# EAGLE design PCB v1.0 (EAGLE 9.6.2)
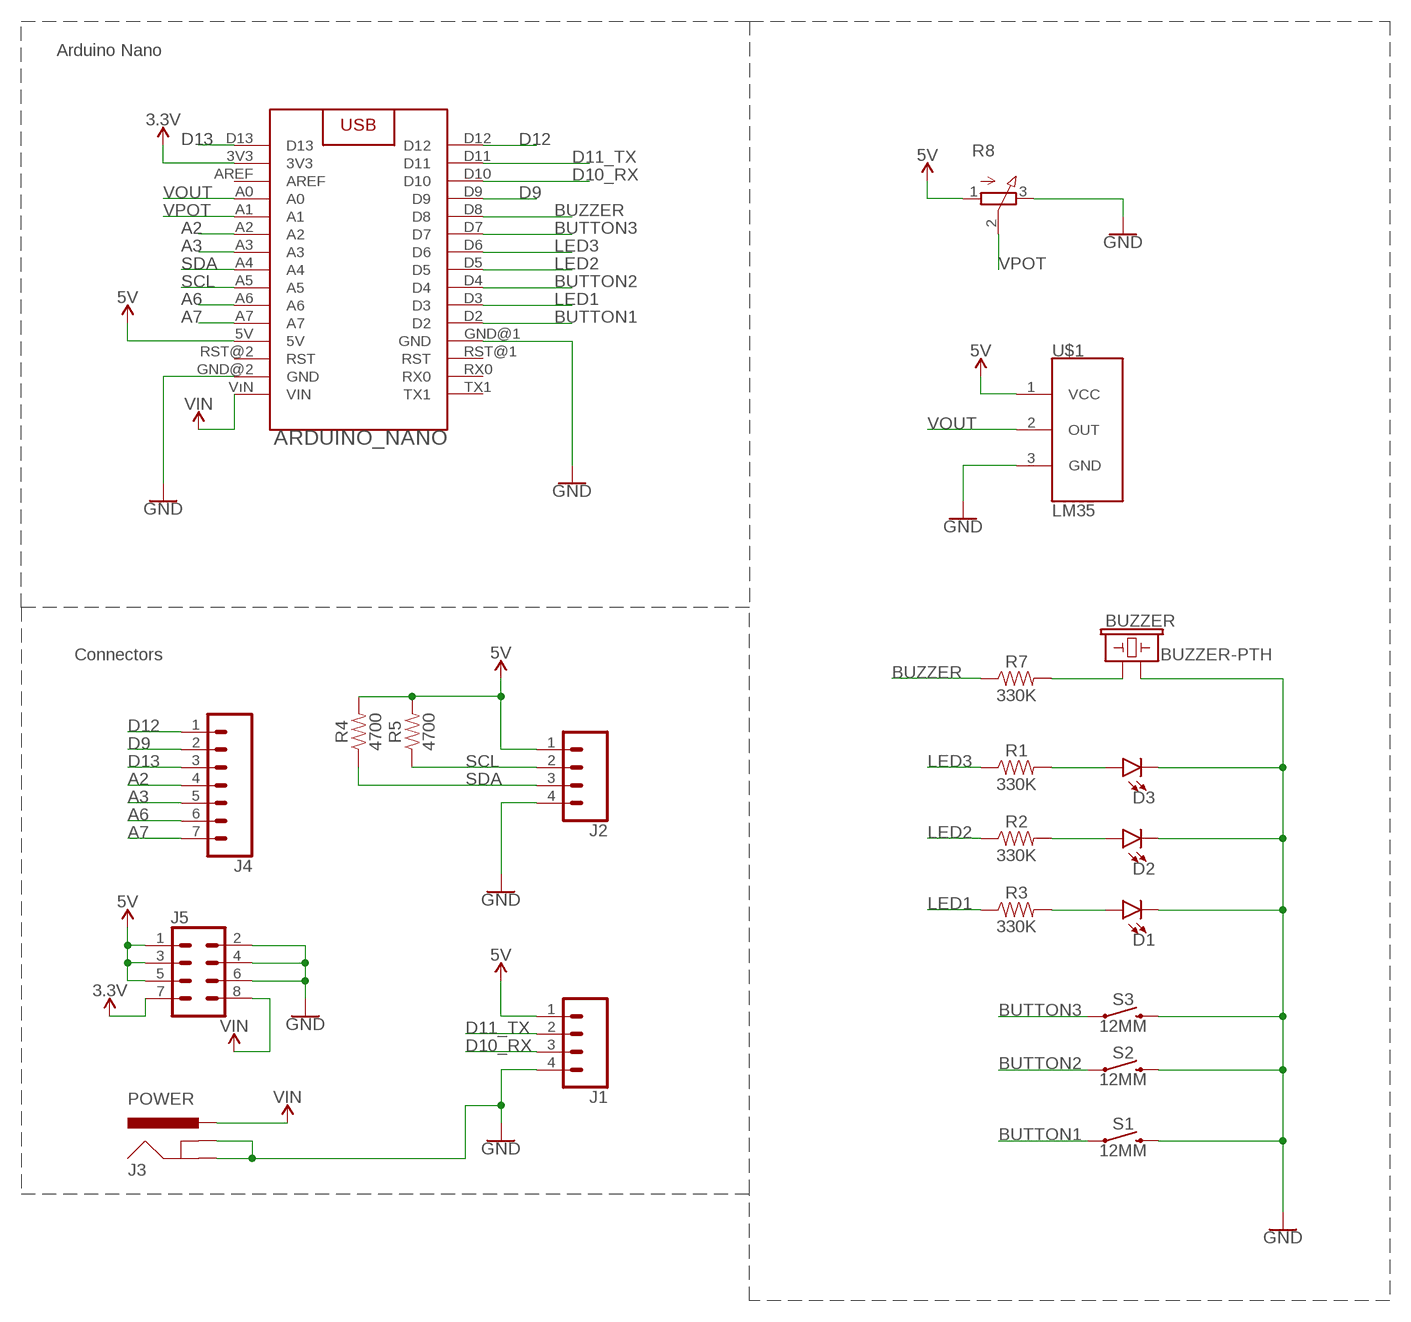
[diagram p0: schematic, sheet 1]

## Parts
ARDUINO_NANO  ARDUINO_NANO  [ARDUINO_NANO]
BUZZER  BUZZER-PTH  [BUZZER-12MM]
D1  LED-3MM-NO_SILK  [LED_3MM-NS]
D2  LED-3MM-NO_SILK  [LED_3MM-NS]
D3  LED-3MM-NO_SILK  [LED_3MM-NS]
J1  CONN_04PTH  [1X04]
J2  CONN_04PTH  [1X04]
J3  POWER  POWER_JACK  [POWER_JACK_PTH]
J4  CONN_07  [1X07]
J5  CONN_04X2  [2X4]
R1  330K  1KOHM-HORIZ-1/4W-5%  [AXIAL-0.3]
R2  330K  1KOHM-HORIZ-1/4W-5%  [AXIAL-0.3]
R3  330K  1KOHM-HORIZ-1/4W-5%  [AXIAL-0.3]
R4  4700  1KOHM-HORIZ-1/4W-5%  [AXIAL-0.3]
R5  4700  1KOHM-HORIZ-1/4W-5%  [AXIAL-0.3]
R7  330K  1KOHM-HORIZ-1/4W-5%  [AXIAL-0.3]
R8  3RP/1610N  [3RP/1610N]
S1  12MM  MOMENTARY-SWITCH-SPST-PTH-12MM  [TACTILE_SWITCH_PTH_12MM]
S2  12MM  MOMENTARY-SWITCH-SPST-PTH-12MM  [TACTILE_SWITCH_PTH_12MM]
S3  12MM  MOMENTARY-SWITCH-SPST-PTH-12MM  [TACTILE_SWITCH_PTH_12MM]
U$1  LM35  [TO-92]

## Nets
3.3V: ARDUINO_NANO.3V3 J5.7
5V: ARDUINO_NANO.5V J1.1 J2.1 J5.1 J5.3 J5.5 R4.P$2 R5.P$2 R8.1(A) U$1.1(VCC)
A2: ARDUINO_NANO.A2 J4.4
A3: ARDUINO_NANO.A3 J4.5
A6: ARDUINO_NANO.A6 J4.6
A7: ARDUINO_NANO.A7 J4.7
BUTTON1: ARDUINO_NANO.D2 S1.1
BUTTON2: ARDUINO_NANO.D4 S2.1
BUTTON3: ARDUINO_NANO.D7 S3.1
BUZZER: ARDUINO_NANO.D8 R7.P$1
D9: ARDUINO_NANO.D9 J4.2
D10_RX: ARDUINO_NANO.D10 J1.3
D11_TX: ARDUINO_NANO.D11 J1.2
D12: ARDUINO_NANO.D12 J4.1
D13: ARDUINO_NANO.D13 J4.3
GND: ARDUINO_NANO.GND@1(GND) ARDUINO_NANO.GND@2(GND) BUZZER.- D1.K(C) D2.K(C) D3.K(C) J1.4 J2.4 J3.GND J3.GNDBREAK J5.2 J5.4 J5.6 R8.3(E) S1.3 S2.3 S3.3 U$1.3(GND)
LED1: ARDUINO_NANO.D3 R3.P$1
LED2: ARDUINO_NANO.D5 R2.P$1
LED3: ARDUINO_NANO.D6 R1.P$1
N$1: BUZZER.+ R7.P$2
N$2: D3.A R1.P$2
N$3: D2.A R2.P$2
N$4: D1.A R3.P$2
SCL: ARDUINO_NANO.A5 J2.2 R5.P$1
SDA: ARDUINO_NANO.A4 J2.3 R4.P$1
VIN: ARDUINO_NANO.VıN(VIN) J3.PWR J5.8
VOUT: ARDUINO_NANO.A0 U$1.2(OUT)
VPOT: ARDUINO_NANO.A1 R8.2(S)
Unconnected: ARDUINO_NANO.AREF ARDUINO_NANO.RST@1(RST) ARDUINO_NANO.RST@2(RST) ARDUINO_NANO.RX0 ARDUINO_NANO.TX1

## Notes on the sheet
- Arduino Nano
- Connectors

## Library data of the parts
ARDUINO_NANO = library_custom:ARDUINO_NANO: Arduino Nano Device
BUZZER = SparkFun-Electromechanical:BUZZER: Buzzer Small round buzzers that operate around the audible 2kHz range. You can use these as speakers to create simple music or user interfaces. Variant Overview: PTH - Mini Speaker - PC Mount 12mm 2.048kHz <https://www.sparkfun.com/products/7950> PTH_KIT - Mini Speaker - PC Mount 12mm 2.048kHz <https://www.sparkfun.com/products/7950> KIT simplifies soldering by adding stop mask to one side of the pads. PTH_NO_SILK - Mini Speaker - PC Mount 12mm 2.048kHz <https://www.sparkfun.com/products/7950> No silkscreen indicator of buzzer outline. PTH_KIT_NO_SILK - Mini Speaker - PC Mount 12mm 2.048kHz <https://www.sparkfun.com/products/7950> KIT package w/o silkscreen SMD - Buzzer Audio Magnetic (CCV-084B16) SMD buzzer used on, e.g. the LilyPad Buzzer <https://www.sparkfun.com/products/8463> and RFID USB Reader <https://www.sparkfun.com/products/9963>. SMD_KIT - Buzzer Audio Magnetic (CCV-084B16) SMD Buzzer with elongated pins to make soldering easier. Used on the SparkFun Simon Says - Surface Mount Soldering Kit <https://www.sparkfun.com/products/10935>. SMD-SQUARE - Buzzer Audio Magnetic (COMP-15701) SMT square buzzer with one chamfered corner.; PROD_ID: COMP-08253; SF_SKU: COM-07950
D1-D3 = SparkFun-LED:LED: LED (Generic) Standard schematic elements and footprints for 5mm, 3mm, 1206, and 0603 sized LEDs. Generic LEDs with no color specified.
J1 J2 = SparkFun-Connectors:CONN_04: Multi connection point. Often used as Generic Header-pin footprint for 0.1 inch spaced/style header connections On any of the 0.1 inch spaced packages, you can populate with these: Break Away Headers - Straight <https://www.sparkfun.com/products/116> (PRT-00116) Break Away Male Headers - Right Angle <https://www.sparkfun.com/products/553> (PRT-00553) Female Headers <https://www.sparkfun.com/products/115> (PRT-00115) Break Away Headers - Machine Pin <https://www.sparkfun.com/products/117> (PRT-00117) Break Away Female Headers - Swiss Machine Pin <https://www.sparkfun.com/products/743> (PRT-00743) For SCREWTERMINALS and SPRING TERMINALS visit here: Screw Terimnals on SparkFun.com <https://www.sparkfun.com/search/results?term=Screw+Terminals> (5mm/3.5mm/2.54mm spacing) This device is also useful as a general connection point to wire up your design to another part of your project. Our various solder wires solder well into these plated through hole pads. Hook-Up Wire - Assortment (Stranded, 22 AWG) <https://www.sparkfun.com/products/11375> (PRT-11375) Hook-Up Wire - Assortment (Solid Core, 22 AWG) <https://www.sparkfun.com/products/11367> (PRT-11367) View the entire wire category on our website here <https://www.sparkfun.com/categories/141> Special notes: Molex polarized connector foot print use with SKU : PRT-08231 with associated crimp pins and housings. 1MM SMD Version SKU: PRT-10208; PROD_ID: CONN-09696
J3 = SparkFun-Connectors:POWER_JACK: Power Jack Connector This is the standard 5.5mm barrel jack for power. The PTH is the most common, proven, reliable, footprint. The Slot footprint only works if the mill layer is transmitted to the PCB fab house so be warned. Here are the connectors we sell at SparkFun: DC Barrel Power Jack/Connector <https://www.sparkfun.com/products/119> (PRT-00119) DC Barrel Power Jack/Connector (SMD) <https://www.sparkfun.com/products/12748> (PRT-12748) DC Barrel Jack Adapter - Breadboard Compatible <https://www.sparkfun.com/products/10811> (PRT-10811) It is used on this SparkFun product (and many, many others): SparkFun RedBoard - Programmed with Arduino <https://www.sparkfun.com/products/12757> (DEV-12757) Also, if you need a mating power supply or connector, please check these out: Wall Adapter Power Supply - 9VDC 650mA <https://www.sparkfun.com/products/298> (TOL-00298) DC Barrel Jack Adapter - Male <https://www.sparkfun.com/products/10287> (PRT-10287); PROD_ID: CONN-08197
J4 = SparkFun-Connectors:CONN_07: Multi connection point. Often used as Generic Header-pin footprint for 0.1 inch spaced/style header connections On any of the 0.1 inch spaced packages, you can populate with these: Break Away Headers - Straight <https://www.sparkfun.com/products/116> (PRT-00116) Break Away Male Headers - Right Angle <https://www.sparkfun.com/products/553> (PRT-00553) Female Headers <https://www.sparkfun.com/products/115> (PRT-00115) Break Away Headers - Machine Pin <https://www.sparkfun.com/products/117> (PRT-00117) Break Away Female Headers - Swiss Machine Pin <https://www.sparkfun.com/products/743> (PRT-00743) For SCREWTERMINALS and SPRING TERMINALS visit here: Screw Terimnals on SparkFun.com <https://www.sparkfun.com/search/results?term=Screw+Terminals> (5mm/3.5mm/2.54mm spacing) This device is also useful as a general connection point to wire up your design to another part of your project. Our various solder wires solder well into these plated through hole pads. Hook-Up Wire - Assortment (Stranded, 22 AWG) <https://www.sparkfun.com/products/11375> (PRT-11375) Hook-Up Wire - Assortment (Solid Core, 22 AWG) <https://www.sparkfun.com/products/11367> (PRT-11367) View the entire wire category on our website here <https://www.sparkfun.com/categories/141> Special notes: Molex polarized connector foot print use with SKU : PRT-08231 with associated crimp pins and housings. 1MM SMD Version SKU: PRT-10208 NOTES ON THE VARIANTS LOCK and LOCK_LONGPADS... This footprint was designed to help hold the alignment of a through-hole component (i.e. 6-pin header) while soldering it into place. You may notice that each hole has been shifted either up or down by 0.005 of an inch from it's more standard position (which is a perfectly straight line). This slight alteration caused the pins (the squares in the middle) to touch the edges of the holes. Because they are alternating, it causes a "brace" to hold the component in place. 0.005 has proven to be the perfect amount of "off-center" position when using our standard breakaway headers. Although looks a little odd when you look at the bare footprint, once you have a header in there, the alteration is very hard to notice. Also,if you push a header all the way into place, it is covered up entirely on the bottom side.
J5 = SparkFun-Connectors:CONN_04X2: Multi connection point. Often used as Generic Header-pin footprint for 0.1 inch spaced/style header connections On any of the 0.1 inch spaced packages, you can populate with these: Break Away Headers - Straight <https://www.sparkfun.com/products/116> (PRT-00116) Break Away Male Headers - Right Angle <https://www.sparkfun.com/products/553> (PRT-00553) Female Headers <https://www.sparkfun.com/products/115> (PRT-00115) Break Away Headers - Machine Pin <https://www.sparkfun.com/products/117> (PRT-00117) Break Away Female Headers - Swiss Machine Pin <https://www.sparkfun.com/products/743> (PRT-00743)
R1-R5 R7 = SparkFun-Resistors:1KOHM: 1kΩ resistor A resistor is a passive two-terminal electrical component that implements electrical resistance as a circuit element. Resistors act to reduce current flow, and, at the same time, act to lower voltage levels within circuits. - Wikipedia; PROD_ID: RES-08380; VALUE: 1k
R8 = pot:3RP/1610N: 16mm Potentiometer one level Source: http://www.alphapotentiometers.net/html/16mm_pot_2.html
S1-S3 = SparkFun-Switches:MOMENTARY-SWITCH-SPST: Momentary Switch (Pushbutton) - SPST Normally-open (NO) SPST momentary switches (buttons, pushbuttons). Variants PTH-12MM - 12mm square, through-hole Momentary Pushbutton Switch - 12mm Square <https://www.sparkfun.com/products/9190> (COM-09190) PTH-6.0MM, PTH-6.0MM-KIT - 6.0mm square, through-hole Mini Pushbutton Switch <https://www.sparkfun.com/products/97> (COM-00097) KIT package intended for soldering kit's - only one side of pads' copper is exposed. PTH-RIGHT-ANGLE-KIT - Right-angle, through-hole Right Angle Tactile Button <https://www.sparkfun.com/products/10791> - Used on SparkFun BigTime Watch Kit <https://www.sparkfun.com/products/11734> SMD-12MM - 12mm square, surface-mount Tactile Button - SMD (12mm) <https://www.sparkfun.com/products/12993> (COM-12993) Used on SparkFun PicoBoard <https://www.sparkfun.com/products/11888> SMD-4.5MM - 4.5mm Square Trackball Switch Used on SparkFun Blackberry Trackballer Breakout <https://www.sparkfun.com/products/13169> SMD-4.6MMX2.8MM - 4.60mm x 2.80mm, surface mount Used on SparkFun Pro Micro - RP2040 <https://www.sparkfun.com/products/17717> SMD-5.2MM, SMD-5.2-REDUNDANT - 5.2mm square, surface-mount Mini Pushbutton Switch - SMD <https://www.sparkfun.com/products/8720> (COM-08720) Used on Arduino Pro Mini <https://www.sparkfun.com/products/11114> REDUNDANT package connects both switch circuits together SMD-6.0X3.5MM - 6.0 x 3.5mm, surface mount Momentary Reset Switch SMD <https://www.sparkfun.com/products/8229> (COM-08229) SMD-6.2MM-TALL - 6.2mm square, surface mount Tactile Button - SMD (6mm) <https://www.sparkfun.com/products/12992> Used on SparkFun Digital Sandbox <https://www.sparkfun.com/products/12651> SMD-RIGHT-ANGLE - Right-angle, surface mount Used on SparkFun Block for Intel® Edison - Arduino <https://www.sparkfun.com/products/13036>; PROD_ID: SWCH-09185; SF_SKU: COM-09190
U$1 = library_custom:LM35

## Board
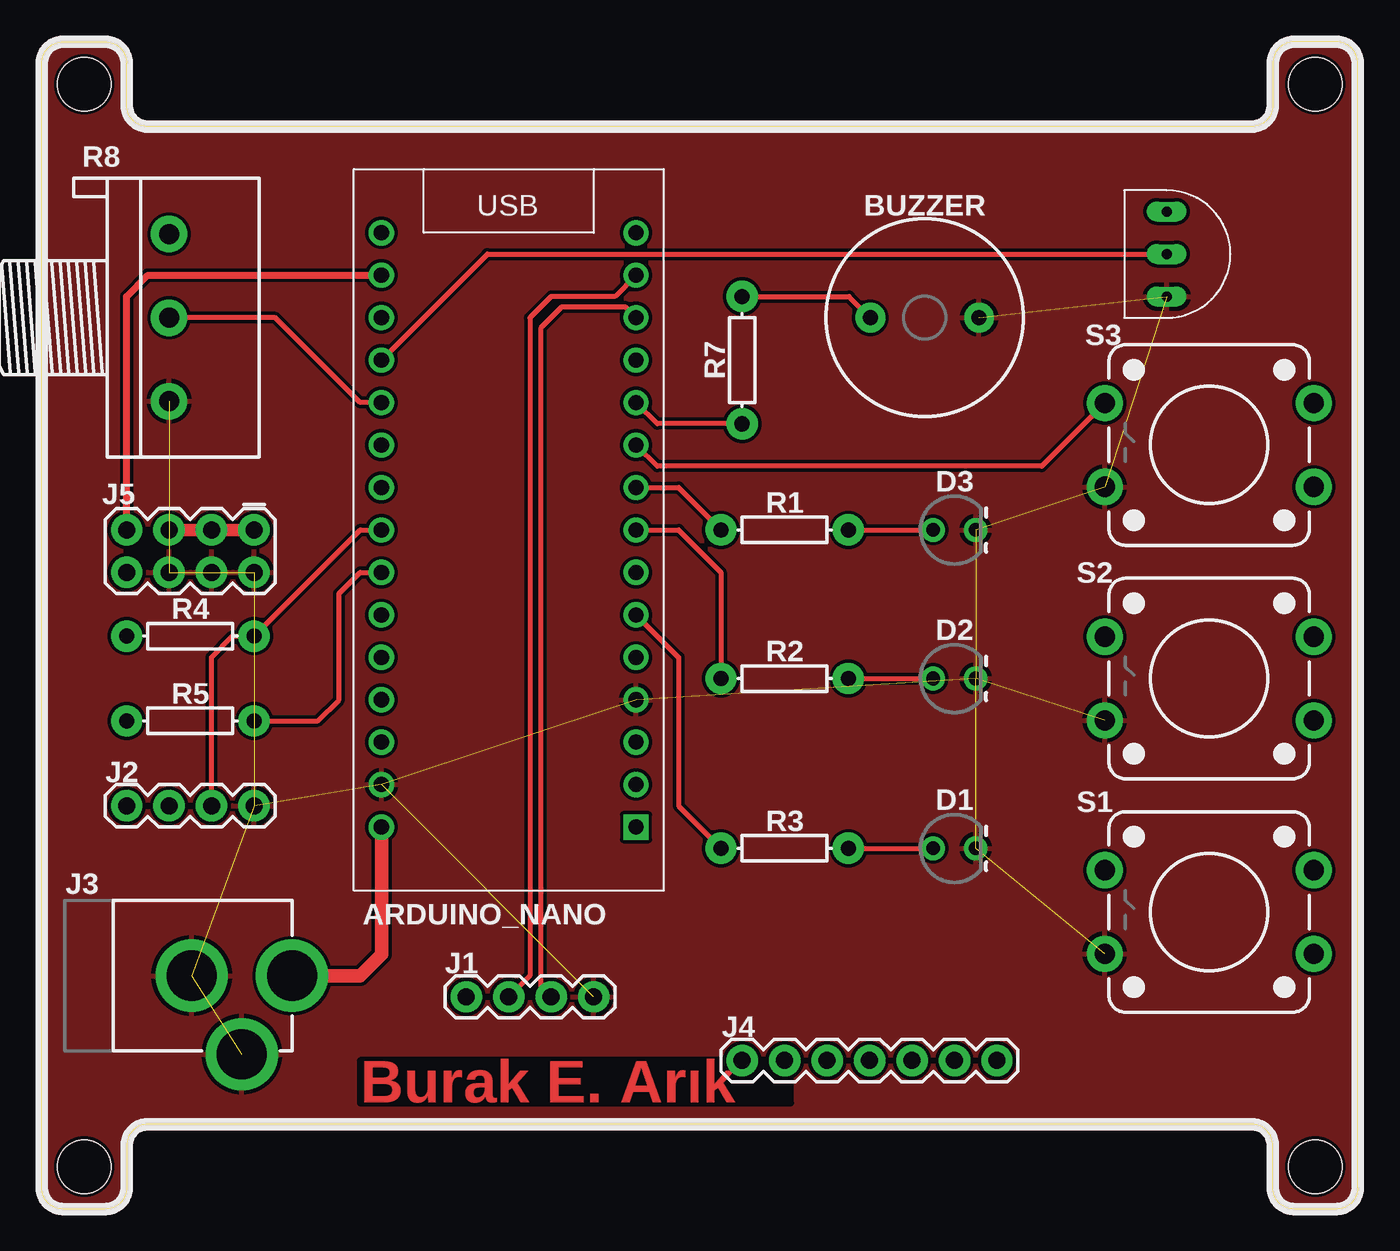
[diagram p1: board, top side]
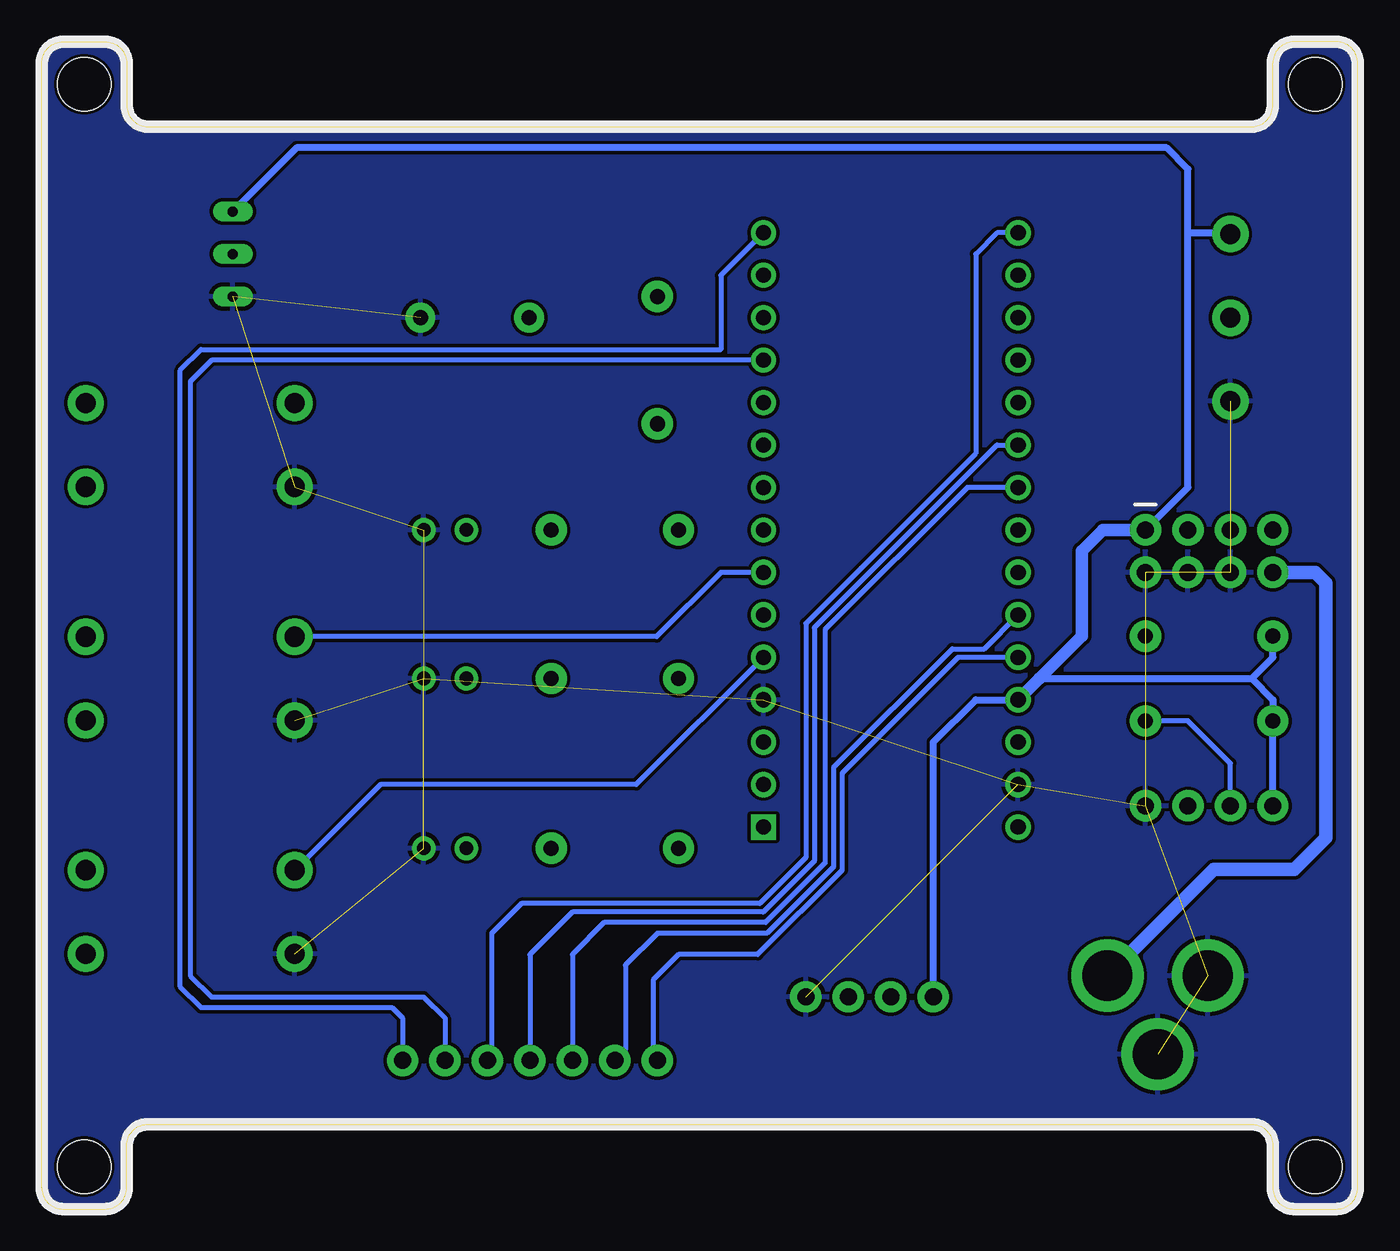
[diagram p2: board, bottom side, seen from below]

Size 78.74 x 69.85 mm. Coordinates in mm from the lower left corner, seen from the top.
Outline: 77.47,0 74.93,0 arc-90 73.66,1.27 73.66,3.81 arc90 72.39,5.08 6.35,5.08 arc90 5.08,3.81 5.08,1.27 arc-90 3.81,0 1.27,0 arc-90 0,1.27 0,68.58 arc-90 1.27,69.85 3.81,69.85 arc-90 5.08,68.58 5.08,66.04 arc90 6.35,64.77 72.39,64.77 arc90 73.66,66.04 73.66,68.58 arc-90 74.93,69.85 77.47,69.85 arc-90 78.74,68.58 78.74,1.27 arc-90 77.47,0
Copper layers (1*16): Top 0.035mm / dielectric 1.5mm / Bottom 0.035mm
Design rules "SparkFun": minimum track width 8mil, minimum drill 20mil, track to track 8mil, track to pad 8mil, pad to pad 8mil, via to via 8mil, smd to smd 8mil, copper to edge 8mil, drill to drill 8mil, minimum pad ring 12mil, minimum via ring 10mil, stop-mask expansion 4mil, vias tented up to drill 20mil, thermal gap 10mil
Holes 3.2 mm at 2.54,67.31 76.2,67.31 76.2,2.54 2.54,2.54

### Footprints (pad centres in the part's own frame; a part is rotated, then mirrored left to right if it is on the bottom)
ARDUINO_NANO = drill 0.9: 3V3 7.62,-15.24; 5V 7.62,10.16; A0 7.62,-10.16; A1 7.62,-7.62; A2 7.62,-5.08; A3 7.62,-2.54; A4 7.62,0; A5 7.62,2.54; A6 7.62,5.08; A7 7.62,7.62; AREF 7.62,-12.7; D2 -7.62,7.62; D3 -7.62,5.08; D4 -7.62,2.54; D5 -7.62,0; D6 -7.62,-2.54; D7 -7.62,-5.08; D8 -7.62,-7.62; D9 -7.62,-10.16; D10 -7.62,-12.7; D11 -7.62,-15.24; D12 -7.62,-17.78; D13 7.62,-17.78; GND@1 -7.62,10.16; GND@2 7.62,15.24; RST@1 -7.62,12.7; RST@2 7.62,12.7; RX0 -7.62,15.24; VıN 7.62,17.78 | drill 0.9 square: TX1 -7.62,17.78
BUZZER-12MM = drill 0.9 pad 1.778: + 3.25,0; - -3.25,0
LED_3MM-NS = drill 0.813: A -1.27,0; K 1.27,0
1X04 = drill 1.016 pad 1.88: 1 0,0; 2 2.54,0; 3 5.08,0; 4 7.62,0
POWER_JACK_PTH = drill 2.997 pad 4.318: GND 0,7.7; GNDBREAK 4.7,10.7; PWR 0,13.7
1X07 = drill 1.016 pad 1.88: 1 0,0; 2 2.54,0; 3 5.08,0; 4 7.62,0; 5 10.16,0; 6 12.7,0; 7 15.24,0
2X4 = drill 1.016 pad 1.88: 1 -3.81,-1.27; 2 -3.81,1.27; 3 -1.27,-1.27; 4 -1.27,1.27; 5 1.27,-1.27; 6 1.27,1.27; 7 3.81,-1.27; 8 3.81,1.27
AXIAL-0.3 = drill 0.9 pad 1.88: P$1 -3.81,0; P$2 3.81,0
3RP/1610N = drill 1.2 pad 2.184: 1 -5,0; 2 0,0; 3 5,0
TACTILE_SWITCH_PTH_12MM = drill 1.2 pad 2.159: 1 6.25,-2.5; 2 -6.25,-2.5; 3 6.25,2.5; 4 -6.25,2.5
TO-92 = drill 0.6 long: 1 -2.54,0; 2 0,0; 3 2.54,0

### Placement (x,y rotation side)
ARDUINO_NANO  27.94,40.64 180 top
BUZZER  52.83,53.34 180 top
D1  54.61,21.59 0 top
D2  54.61,31.75 0 top
D3  54.61,40.64 0 top
J1  25.4,12.7 0 top
J2  5.08,24.13 0 top
J3  1.27,13.97 270 top
J4  57.15,8.89 180 top
J5  8.89,39.37 180 top
R1  44.45,40.64 0 top
R2  44.45,31.75 0 top
R3  44.45,21.59 0 top
R4  8.89,34.29 180 top
R5  8.89,29.21 180 top
R7  41.91,50.8 90 top
R8  7.62,53.34 270 top
S1  69.85,17.78 180 top
S2  69.85,31.75 180 top
S3  69.85,45.72 180 top
U$1  67.31,57.15 270 top

### Tracks (layer width: path | path; a pad name or v marks a point on that pad's centre or on a via)
3.3V
  Top 0.406: J5.7 5.08,54.61 6.35,55.88 ARDUINO_NANO.3V3
5V
  Top 0.762: J5.5 J5.3 J5.1
  Bottom 0.406: 19.05,31.75 6.35,31.75 | 6.35,31.75 5.08,33.02 R4.P$2 | 6.35,31.75 5.08,30.48 R5.P$2 J2.1 | J5.1 10.16,43.18 10.16,58.42 | 10.16,58.42 10.16,62.23 11.43,63.5 63.5,63.5 U$1.1 | J1.1 25.4,27.94 22.86,30.48 ARDUINO_NANO.5V | 10.16,58.42 7.7,58.42 R8.1
  Bottom 0.762: ARDUINO_NANO.5V 19.05,31.75 16.51,34.29 16.51,39.37 15.24,40.64 J5.1
A2
  Bottom 0.305: ARDUINO_NANO.A2 21.59,45.72 32.51,34.8 32.51,20.83 35.56,17.78 46.99,17.78 49.53,15.24 J4.4
A3
  Bottom 0.305: J4.5 46.99,15.24 45.09,17.15 35.43,17.15 31.88,20.7 31.88,34.67 23.37,43.18 ARDUINO_NANO.A3
A6
  Bottom 0.305: ARDUINO_NANO.A6 22.35,33.53 24.26,33.53 31.37,26.42 31.37,20.49 35.35,16.51 41.91,16.51 43.81,14.61 43.81,9.53 J4.6
A7
  Bottom 0.305: ARDUINO_NANO.A7 23.92,33.02 30.86,26.08 30.86,20.28 35.9,15.24 40.64,15.24 42.16,13.72 42.16,9.14 J4.7
BUTTON1
  Bottom 0.305: ARDUINO_NANO.D2 43.18,25.4 58.48,25.4 S1.1
BUTTON2
  Bottom 0.305: ARDUINO_NANO.D4 38.1,38.1 41.95,34.25 S2.1
BUTTON3
  Top 0.305: S3.1 59.83,44.45 36.83,44.45 ARDUINO_NANO.D7
BUZZER
  Top 0.305: R7.P$1 36.83,46.99 ARDUINO_NANO.D8
D9
  Bottom 0.305: ARDUINO_NANO.D9 68.58,50.8 69.85,49.53 69.85,13.97 68.58,12.7 55.88,12.7 54.61,11.43 J4.2
D10_RX
  Top 0.305: ARDUINO_NANO.D10 34.92,53.98 31.11,53.98 29.84,52.7 29.84,13.34 J1.3
D11_TX
  Top 0.305: ARDUINO_NANO.D11 34.29,54.61 30.48,54.61 29.21,53.34 29.21,13.97 J1.2
D12
  Bottom 0.305: ARDUINO_NANO.D12 38.1,55.88 38.1,51.44 69.22,51.44 70.48,50.16 70.48,13.34 69.22,12.07 57.78,12.07 57.15,11.43 J4.1
D13
  Bottom 0.305: J4.3 51.82,9.14 51.82,16.51 50.04,18.29 35.77,18.29 33.02,21.04 33.02,35.05 22.86,45.21 22.86,57.15 21.59,58.42 ARDUINO_NANO.D13
GND  (17 unrouted)
  pour Top: 3.81,72.39 -2.54,72.39 -2.54,-2.54 81.28,-2.54 81.28,72.39
  pour Bottom: -5.08,72.39 -5.08,-5.08 83.82,-5.08 83.82,74.93 -5.08,74.93
LED1
  Top 0.305: ARDUINO_NANO.D3 38.1,33.02 38.1,24.13 R3.P$1
LED2
  Top 0.305: ARDUINO_NANO.D5 38.1,40.64 40.64,38.1 R2.P$1
LED3
  Top 0.305: ARDUINO_NANO.D6 38.1,43.18 R1.P$1
N$1
  Top 0.305: R7.P$2 48.31,54.61 BUZZER.+
N$2
  Top 0.305: R1.P$2 D3.A
N$3
  Top 0.305: R2.P$2 D2.A
N$4
  Top 0.305: R3.P$2 D1.A
SCL
  Top 0.305: R5.P$1 16.51,29.21 17.78,30.48 17.78,36.83 19.05,38.1 ARDUINO_NANO.A5
  Bottom 0.305: J2.2 7.62,26.67 10.16,29.21 R5.P$1
SDA
  Top 0.305: ARDUINO_NANO.A4 19.05,40.64 R4.P$1 11.43,34.29 10.16,33.02 J2.3
VIN
  Top 0.813: J3.PWR 19.05,13.97 20.32,15.24 ARDUINO_NANO.VıN
  Bottom 0.813: J3.PWR 8.62,20.32 3.81,20.32 1.91,22.23 1.91,37.47 2.54,38.1 J5.8
VOUT
  Top 0.305: ARDUINO_NANO.A0 26.67,57.15 U$1.2
VPOT
  Top 0.305: ARDUINO_NANO.A1 19.05,48.26 13.97,53.34 R8.2

### Text on the board
Top: Burak E. Arık
tStop: Burak E. Arık